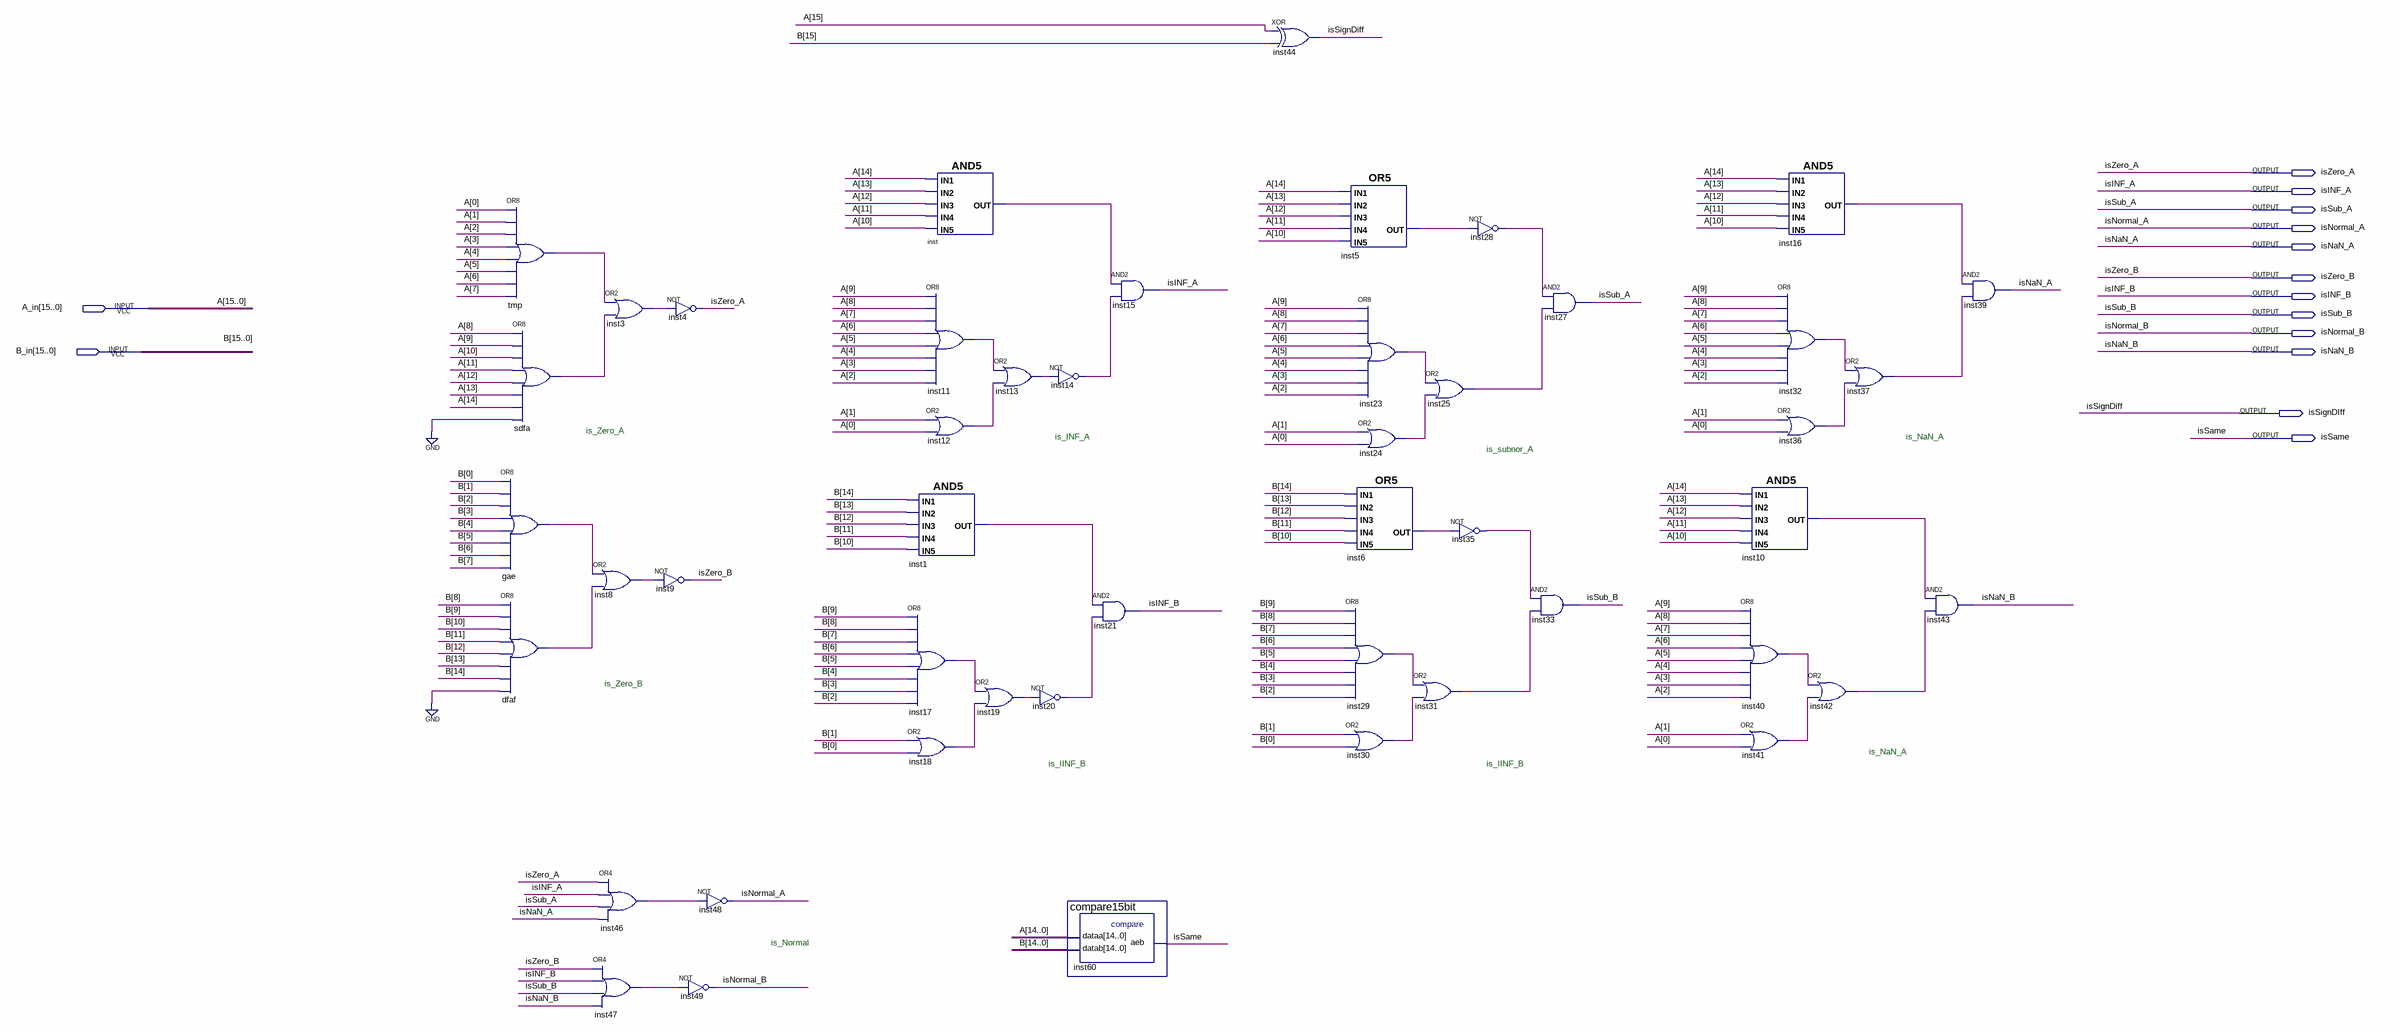
[diagram p0: schematic sheet]
// Quartus schematic SpecialCase_detector.bdf as structural Verilog: 48 symbols, 14 pins
module SpecialCase_detector (
  input  [15:0] A_in,
  input  [15:0] B_in,
  output isZero_A,
  output isINF_A,
  output isSub_A,
  output isNormal_A,
  output isNaN_A,
  output isZero_B,
  output isINF_B,
  output isSub_B,
  output isNormal_B,
  output isNaN_B,
  output isSignDIff,
  output isSame
);

  wire dfaf_out, gae_out, inst1_out, inst3_out, inst5_out, inst6_out, inst8_out, inst10_out, inst11_out,
       inst12_out, inst13_out, inst14_out, inst16_out, inst17_out, inst18_out, inst19_out, inst20_out,
       inst23_out, inst24_out, inst25_out, inst28_out, inst29_out, inst30_out, inst31_out, inst32_out,
       inst35_out, inst36_out, inst37_out, inst40_out, inst41_out, inst42_out, inst46_out, inst47_out,
       inst_out, sdfa_out, tmp_out;

  or gae (gae_out, B_in[0], B_in[1], B_in[2], B_in[3], B_in[4], B_in[5], B_in[6], B_in[7]);
  or dfaf (dfaf_out, B_in[8], B_in[9], B_in[10], B_in[11], B_in[12], B_in[13], B_in[14], 1'b0);
  or tmp (tmp_out, A_in[0], A_in[1], A_in[2], A_in[3], A_in[4], A_in[5], A_in[6], A_in[7]);
  or sdfa (sdfa_out, A_in[8], A_in[9], A_in[10], A_in[11], A_in[12], A_in[13], A_in[14], 1'b0);
  or inst8 (inst8_out, gae_out, dfaf_out);
  or inst46 (inst46_out, isZero_A, isINF_A, isSub_A, isNaN_A);
  or inst47 (inst47_out, isZero_B, isINF_B, isSub_B, isNaN_B);
  or inst3 (inst3_out, tmp_out, sdfa_out);
  not inst4 (isZero_A, inst3_out);
  not inst9 (isZero_B, inst8_out);
  not inst48 (isNormal_A, inst46_out);
  not inst49 (isNormal_B, inst47_out);
  and inst (inst_out, A_in[14], A_in[13], A_in[12], A_in[11], A_in[10]);
  or inst11 (inst11_out, A_in[9], A_in[8], A_in[7], A_in[6], A_in[5], A_in[4], A_in[3], A_in[2]);
  or inst12 (inst12_out, A_in[1], A_in[0]);
  and inst1 (inst1_out, B_in[14], B_in[13], B_in[12], B_in[11], B_in[10]);
  or inst17 (inst17_out, B_in[9], B_in[8], B_in[7], B_in[6], B_in[5], B_in[4], B_in[3], B_in[2]);
  or inst18 (inst18_out, B_in[1], B_in[0]);
  or inst13 (inst13_out, inst11_out, inst12_out);
  or inst19 (inst19_out, inst17_out, inst18_out);
  not inst20 (inst20_out, inst19_out);
  not inst14 (inst14_out, inst13_out);
  and inst21 (isINF_B, inst1_out, inst20_out);
  compare15bit inst60 (.dataa(A_in[14:0]), .datab(B_in[14:0]), .aeb(isSame));
  and inst15 (isINF_A, inst_out, inst14_out);
  xor inst44 (isSignDIff, A_in[15], B_in[15]);
  or inst5 (inst5_out, A_in[14], A_in[13], A_in[12], A_in[11], A_in[10]);
  or inst23 (inst23_out, A_in[9], A_in[8], A_in[7], A_in[6], A_in[5], A_in[4], A_in[3], A_in[2]);
  or inst24 (inst24_out, A_in[1], A_in[0]);
  or inst6 (inst6_out, B_in[14], B_in[13], B_in[12], B_in[11], B_in[10]);
  or inst29 (inst29_out, B_in[9], B_in[8], B_in[7], B_in[6], B_in[5], B_in[4], B_in[3], B_in[2]);
  or inst30 (inst30_out, B_in[1], B_in[0]);
  or inst25 (inst25_out, inst23_out, inst24_out);
  or inst31 (inst31_out, inst29_out, inst30_out);
  not inst28 (inst28_out, inst5_out);
  not inst35 (inst35_out, inst6_out);
  and inst33 (isSub_B, inst35_out, inst31_out);
  and inst27 (isSub_A, inst28_out, inst25_out);
  and inst16 (inst16_out, A_in[14], A_in[13], A_in[12], A_in[11], A_in[10]);
  or inst32 (inst32_out, A_in[9], A_in[8], A_in[7], A_in[6], A_in[5], A_in[4], A_in[3], A_in[2]);
  or inst36 (inst36_out, A_in[1], A_in[0]);
  and inst10 (inst10_out, A_in[14], A_in[13], A_in[12], A_in[11], A_in[10]);
  or inst40 (inst40_out, A_in[9], A_in[8], A_in[7], A_in[6], A_in[5], A_in[4], A_in[3], A_in[2]);
  or inst41 (inst41_out, A_in[1], A_in[0]);
  or inst42 (inst42_out, inst40_out, inst41_out);
  or inst37 (inst37_out, inst32_out, inst36_out);
  and inst43 (isNaN_B, inst10_out, inst42_out);
  and inst39 (isNaN_A, inst16_out, inst37_out);

  // Other names for the same wires on the sheet: A[15:0] = A_in; B[15:0] = B_in

  // Notes on the sheet:
  //   is_Zero_A
  //   is_INF_A
  //   is_NaN_A
  //   is_subnor_A
  //   is_Zero_B
  //   is_NaN_A
  //   is_IINF_B
  //   is_IINF_B
  //   is_Normal
endmodule
